# EAGLE design ME433_sunyue (EAGLE 7.2.0)
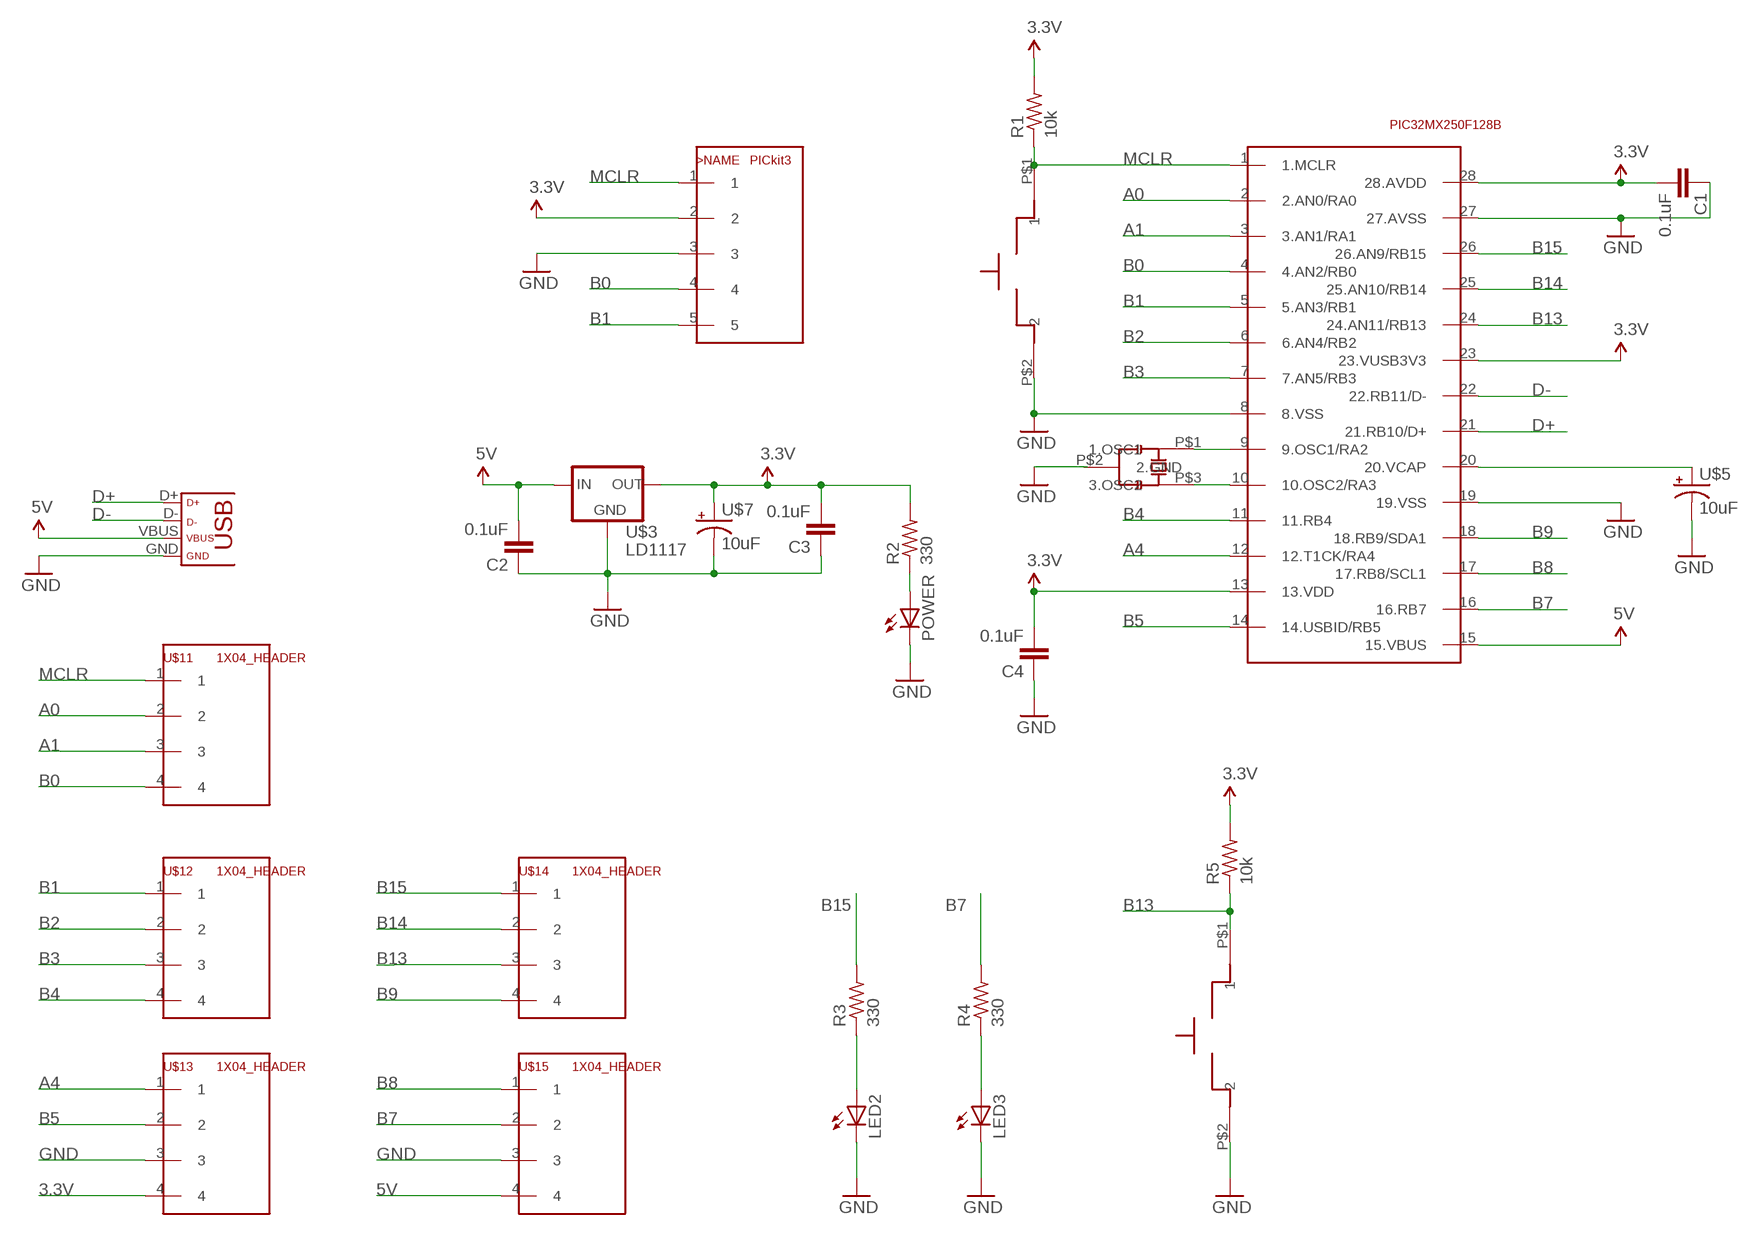
[diagram p0: schematic, sheet 1]

## Parts
>NAME  PICkit3  1X05_HEADER  [1X05]
C1  0.1uF  C-EU025-025X050  [C025-025X050]
C2  0.1uF  C-EU025-025X050  [C025-025X050]
C3  0.1uF  C-EU025-025X050  [C025-025X050]
C4  0.1uF  C-EU025-025X050  [C025-025X050]
LED2  LED3MM  [LED3MM]
LED3  LED3MM  [LED3MM]
POWER  LED3MM  [LED3MM]
R1  10k  R-US_0207/10  [0207/10]
R2  330  R-US_0207/10  [0207/10]
R3  330  R-US_0207/10  [0207/10]
R4  330  R-US_0207/10  [0207/10]
R5  10k  R-US_0207/10  [0207/10]
RESET  RESET  BUTTON  [BUTTON]
U$1  PIC32MX250F128B  [DIL28-3]
U$2  CRYSTAL  [CRYSTAL]
U$3  LD1117  [TO220]
U$5  10uF  CAP_POL  [CAP_POL_D]
U$7  10uF  CAP_POL  [CAP_POL_D]
U$9  USB  [USB-MINIB]
U$11  1X04_HEADER  [1X04]
U$12  1X04_HEADER  [1X04]
U$13  1X04_HEADER  [1X04]
U$14  1X04_HEADER  [1X04]
U$15  1X04_HEADER  [1X04]
USER  BUTTON  [BUTTON]

## Nets
3.3V: >NAME.2 C1.2 C3.2 C4.2 R1.2 R2.2 R5.2 U$1.13(13.VDD) U$1.23(23.VUSB3V3) U$1.28(28.AVDD) U$3.2(OUT) U$7.1(+) U$13.4
5V: C2.2 U$1.15(15.VBUS) U$3.3(IN) U$9.VBUS U$15.4
A0: U$1.2(2.AN0/RA0) U$11.2
A1: U$1.3(3.AN1/RA1) U$11.3
A4: U$1.12(12.T1CK/RA4) U$13.1
B0: >NAME.4 U$1.4(4.AN2/RB0) U$11.4
B1: >NAME.5 U$1.5(5.AN3/RB1) U$12.1
B2: U$1.6(6.AN4/RB2) U$12.2
B3: U$1.7(7.AN5/RB3) U$12.3
B4: U$1.11(11.RB4) U$12.4
B5: U$1.14(14.USBID/RB5) U$13.2
B7: R4.2 U$1.16(16.RB7) U$15.2
B8: U$1.17(17.RB8/SCL1) U$15.1
B9: U$1.18(18.RB9/SDA1) U$14.4
B13: R5.1 U$1.24(24.AN11/RB13) U$14.3 USER.P$1
B14: U$1.25(25.AN10/RB14) U$14.2
B15: R3.2 U$1.26(26.AN9/RB15) U$14.1
D+: U$1.21(21.RB10/D+) U$9.D+
D-: U$1.22(22.RB11/D-) U$9.D-
GND: >NAME.3 C1.1 C2.1 C3.1 C4.1 LED2.K(C) LED3.K(C) POWER.K(C) RESET.P$2 U$1.8(8.VSS) U$1.19(19.VSS) U$1.27(27.AVSS) U$3.1(GND) U$5.2(-) U$7.2(-) U$9.GND U$13.3 U$15.3 USER.P$2
MCLR: >NAME.1 R1.1 RESET.P$1 U$1.1(1.MCLR) U$11.1
N$1: U$1.9(9.OSC1/RA2) U$2.P$1(1.OSC1)
N$2: U$1.10(10.OSC2/RA3) U$2.P$3(3.OSC2)
N$3: U$1.20(20.VCAP) U$5.1(+)
N$4: POWER.A R2.1
N$5: LED2.A R3.1
N$6: LED3.A R4.1
Unconnected: U$2.P$2(2.GND)

## Library data of the parts
>NAME = ME433:1X05_HEADER
C1-C4 = ME433:C-EU: CAPACITOR, European symbol
LED2 LED3 POWER = ME433:LED: LED OSRAM: - CHIPLED LG R971, LG N971, LY N971, LG Q971, LY Q971, LO R971, LY R971 LH N974, LH R974 LS Q976, LO Q976, LY Q976 LO Q996 - Hyper CHIPLED LW Q18S LB Q993, LB Q99A, LB R99A - SideLED LS A670, LO A670, LY A670, LG A670, LP A670 LB A673, LV A673, LT A673, LW A673 LH A674 LY A675 LS A676, LA A676, LO A676, LY A676, LW A676 LS A679, LY A679, LG A679 - Hyper Micro SIDELED® LS Y876, LA Y876, LO Y876, LY Y876 LT Y87S - SmartLED LW L88C, LW L88S LB L89C, LB L89S, LG L890 LS L89K, LO L89K, LY L89K LS L896, LA L896, LO L896, LY L896 - TOPLED LS T670, LO T670, LY T670, LG T670, LP T670 LSG T670, LSP T670, LSY T670, LOP T670, LYG T670 LG T671, LOG T671, LSG T671 LB T673, LV T673, LT T673, LW T673 LH T674 LS T676, LA T676, LO T676, LY T676, LB T676, LH T676, LSB T676, LW T676 LB T67C, LV T67C, LT T67C, LS T67K, LO T67K, LY T67K, LW E67C LS E67B, LA E67B, LO E67B, LY E67B, LB E67C, LV E67C, LT E67C LW T67C LS T679, LY T679, LG T679 LS T770, LO T770, LY T770, LG T770, LP T770 LB T773, LV T773, LT T773, LW T773 LH T774 LS E675, LA E675, LY E675, LS T675 LS T776, LA T776, LO T776, LY T776, LB T776 LHGB T686 LT T68C, LB T68C - Hyper Mini TOPLED® LB M676 - Mini TOPLED Santana® LG M470 LS M47K, LO M47K, LY M47K Source: http://www.osram.convergy.de LUXEON: - LUMILED® LXK2-PW12-R00, LXK2-PW12-S00, LXK2-PW14-U00, LXK2-PW14-V00 LXK2-PM12-R00, LXK2-PM12-S00, LXK2-PM14-U00 LXK2-PE12-Q00, LXK2-PE12-R00, LXK2-PE12-S00, LXK2-PE14-T00, LXK2-PE14-U00 LXK2-PB12-K00, LXK2-PB12-L00, LXK2-PB12-M00, LXK2-PB14-N00, LXK2-PB14-P00, LXK2-PB14-Q00 LXK2-PR12-L00, LXK2-PR12-M00, LXK2-PR14-Q00, LXK2-PR14-R00 LXK2-PD12-Q00, LXK2-PD12-R00, LXK2-PD12-S00 LXK2-PH12-R00, LXK2-PH12-S00 LXK2-PL12-P00, LXK2-PL12-Q00, LXK2-PL12-R00 Source: www.luxeon.com KINGBRIGHT: KA-3528ASYC Source: www.kingbright.com
R1-R5 = ME433:R-US_: RESISTOR, American symbol
RESET USER = ME433:BUTTON
U$1 = ME433:PIC32MX250F128B
U$2 = ME433:CRYSTAL
U$3 = ME433:LD1117
U$5 U$7 = ME433:CAP_POL
U$9 = ME433:USB
U$11-U$15 = ME433:1X04_HEADER

## Board
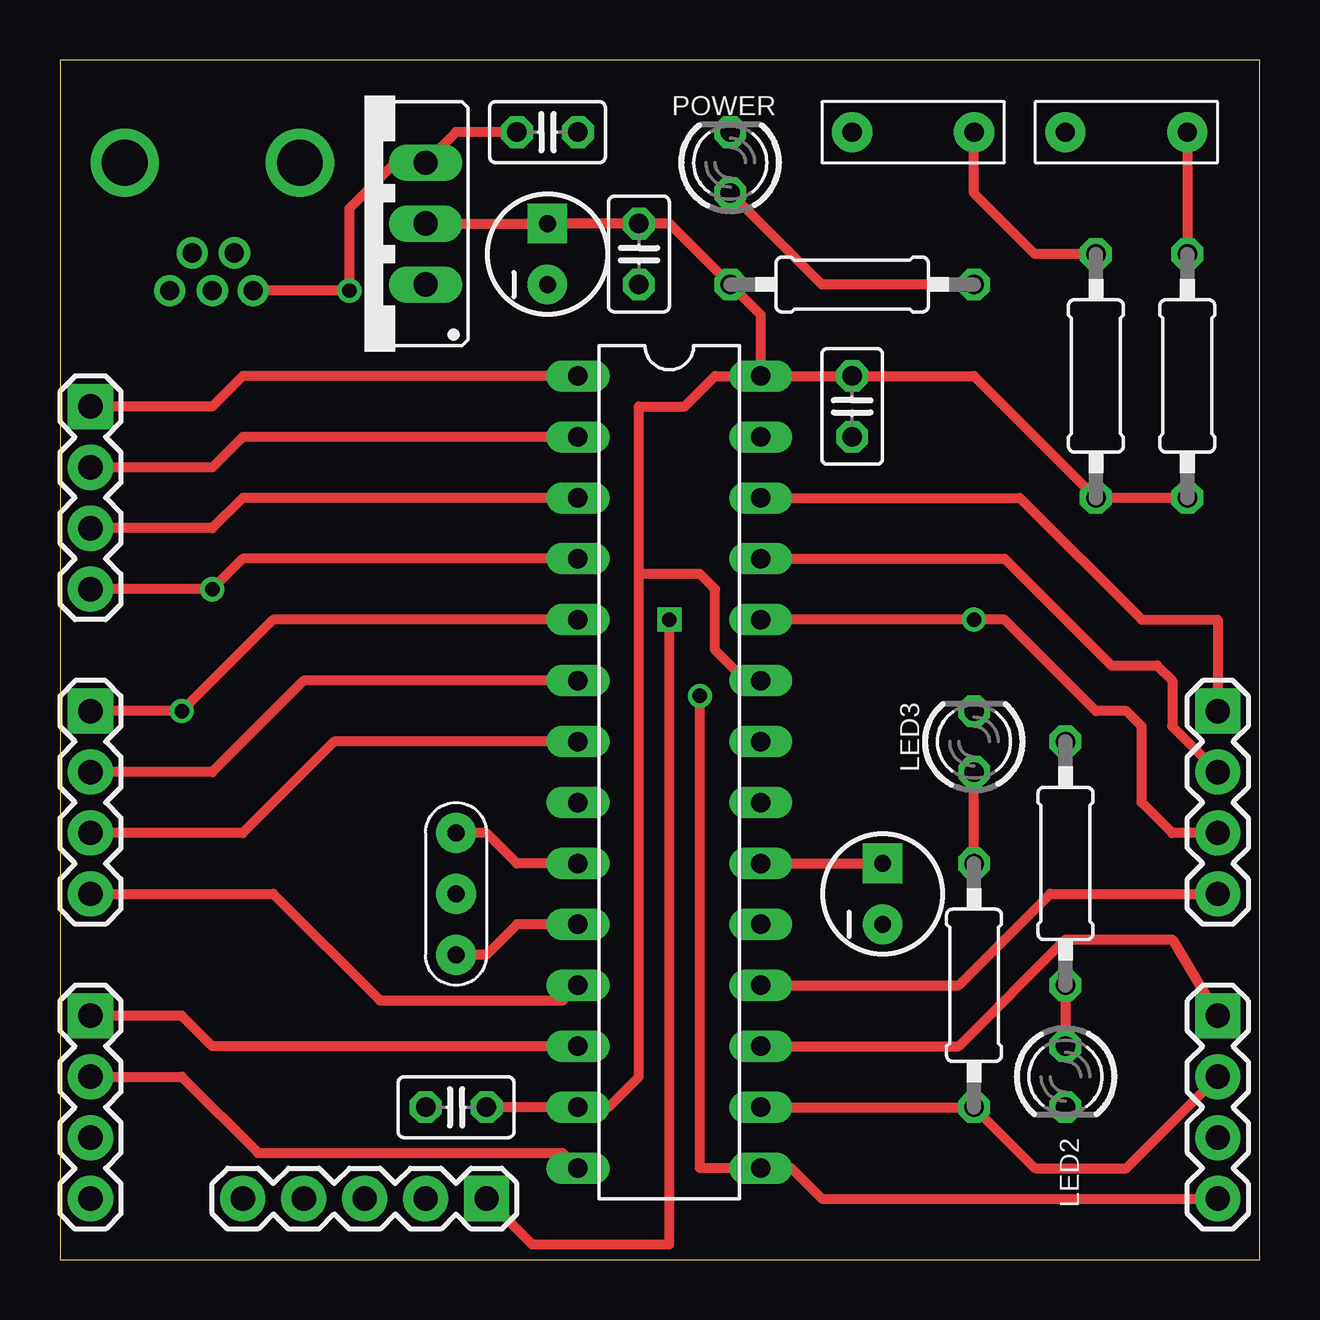
[diagram p1: board, top side]
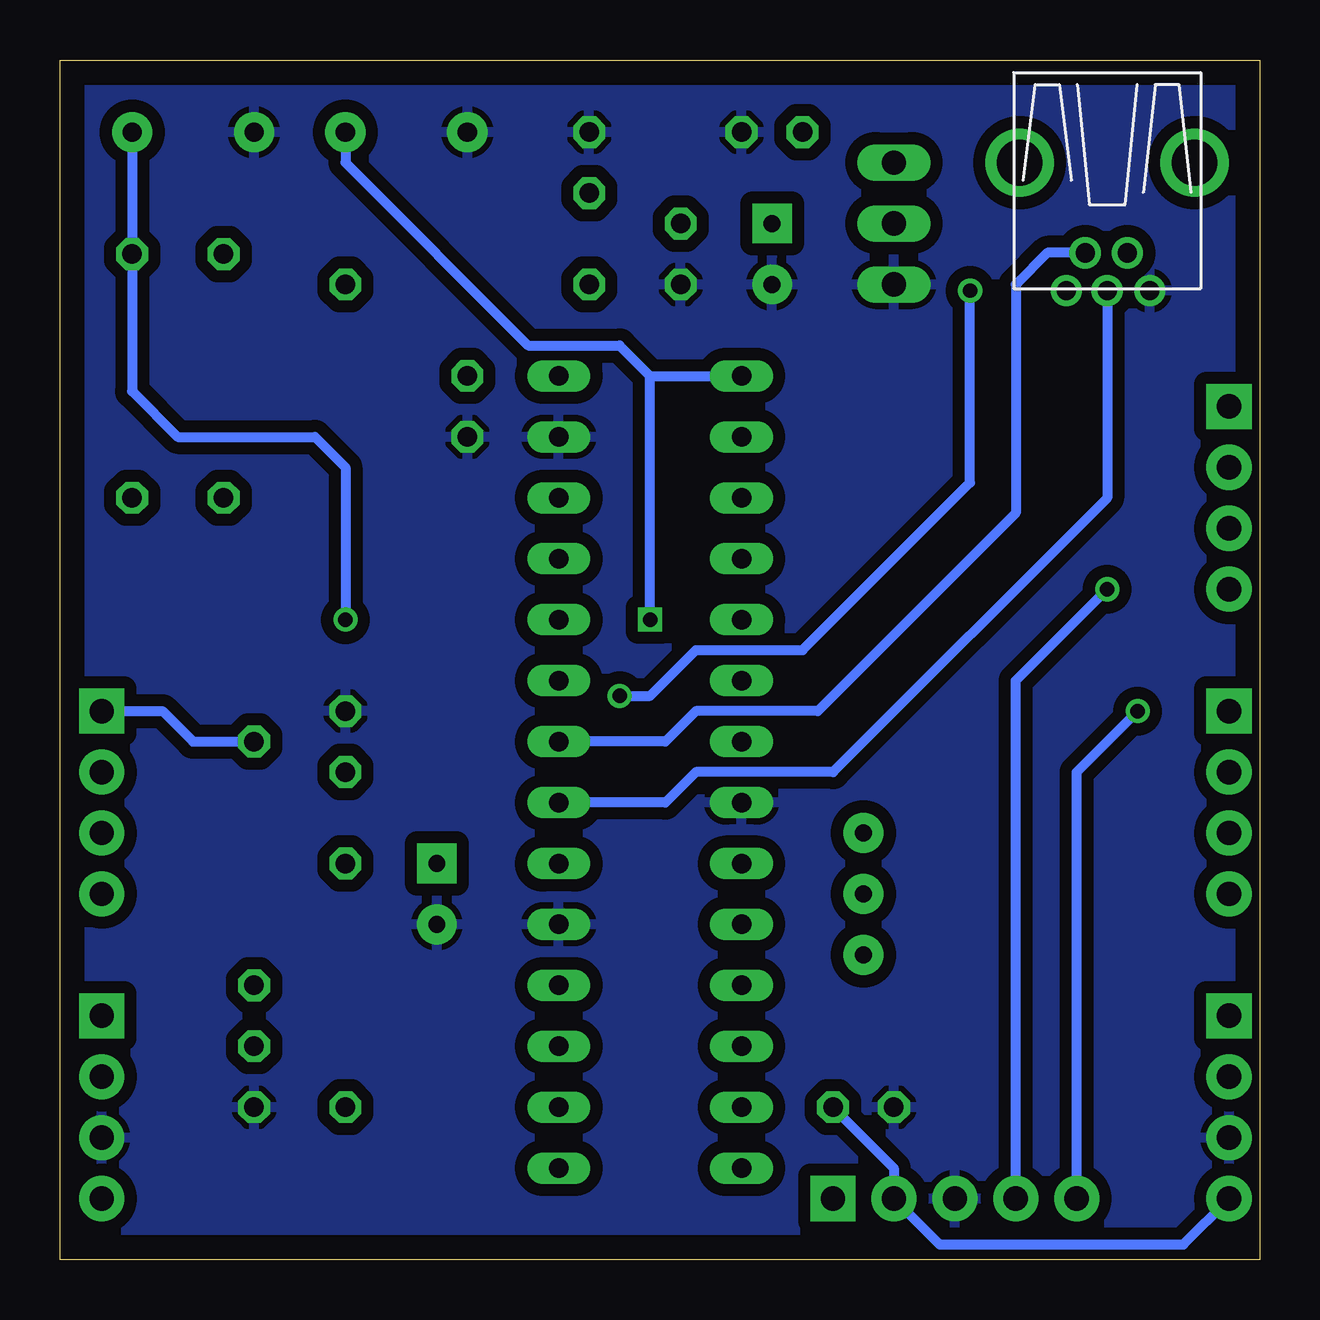
[diagram p2: board, bottom side, seen from below]

Size 50 x 50 mm. Coordinates in mm from the lower left corner, seen from the top.
Outline: 0,0 50,0 50,50 0,50 0,0
Copper layers (1*16): Top 0.035mm / dielectric 1.5mm / Bottom 0.035mm
Design rules "default": minimum track width 10mil, minimum drill 24mil, track to track 8mil, track to pad 8mil, pad to pad 8mil, via to via 8mil, smd to smd 8mil, copper to edge 40mil, drill to drill 8mil, minimum pad ring 10mil, minimum via ring 8mil, stop-mask expansion 4mil, vias tented up to drill 0mil, thermal gap 10mil

### Footprints (pad centres in the part's own frame; a part is rotated, then mirrored left to right if it is on the bottom)
1X05 = drill 1.016 pad 1.88 square: 1 0,0 | drill 1.016 pad 1.88: 2 2.54,0; 3 5.08,0; 4 7.62,0; 5 10.16,0
C025-025X050 = drill 0.813 octagon: 1 -1.27,0; 2 1.27,0
LED3MM = drill 0.813 octagon: A -1.27,0; K 1.27,0
0207/10 = drill 0.813 octagon: 1 -5.08,0; 2 5.08,0
BUTTON = drill 0.8 pad 1.676: P$1 -2.54,0; P$2 2.54,0
DIL28-3 = drill 0.813 long: 1 -16.51,-3.81; 2 -13.97,-3.81; 3 -11.43,-3.81; 4 -8.89,-3.81; 5 -6.35,-3.81; 6 -3.81,-3.81; 7 -1.27,-3.81; 8 1.27,-3.81; 9 3.81,-3.81; 10 6.35,-3.81; 11 8.89,-3.81; 12 11.43,-3.81; 13 13.97,-3.81; 14 16.51,-3.81; 15 16.51,3.81; 16 13.97,3.81; 17 11.43,3.81; 18 8.89,3.81; 19 6.35,3.81; 20 3.81,3.81; 21 1.27,3.81; 22 -1.27,3.81; 23 -3.81,3.81; 24 -6.35,3.81; 25 -8.89,3.81; 26 -11.43,3.81; 27 -13.97,3.81; 28 -16.51,3.81
CRYSTAL = drill 0.7 pad 1.676: P$1 -2.54,0; P$2 0,0; P$3 2.54,0
TO220 = drill 1.016 long: 1 -2.54,0; 2 0,0; 3 2.54,0
CAP_POL_D = drill 0.7 pad 1.651 square: 1 1.27,0 | drill 0.7 pad 1.651: 2 -1.27,0
USB-MINIB = drill 0.8: D+ 4.064,0; D- 2.489,0.914; GND 4.064,-1.778; ID 2.489,-0.838; VBUS 4.064,1.702 | drill 1.9: P$6 -1.27,-3.65; P$7 -1.27,3.65
1X04 = drill 1.016 pad 1.88 square: 1 0,0 | drill 1.016 pad 1.88: 2 2.54,0; 3 5.08,0; 4 7.62,0

### Placement (x,y rotation side)
>NAME  17.78,2.54 180 top
C1  24.13,41.91 90 top
C2  20.32,46.99 180 top
C3  33.02,35.56 90 top
C4  16.51,6.35 0 top
LED2  41.91,7.62 270 top
LED3  38.1,21.59 90 top
POWER  27.94,45.72 90 top
R1  43.18,36.83 270 top
R2  33.02,40.64 180 top
R3  41.91,16.51 90 top
R4  38.1,11.43 270 top
R5  46.99,36.83 270 top
RESET  35.56,46.99 180 top
U$1  25.4,20.32 270 top
U$2  16.51,15.24 270 top
U$3  15.24,43.18 90 top
U$5  34.29,15.24 90 top
U$7  20.32,41.91 90 top
U$9  6.35,44.45 270 top
U$11  1.27,35.56 270 top
U$12  1.27,22.86 270 top
U$13  1.27,10.16 270 top
U$14  48.26,22.86 270 top
U$15  48.26,10.16 270 top
USER  44.45,46.99 180 top

### Tracks (layer width: path | path; a pad name or v marks a point on that pad's centre or on a via)
3.3V
  Top 0.406: R5.2 R1.2 38.1,36.83 C3.2 U$1.28 | U$1.28 29.21,39.37 R2.2 25.4,43.18 C1.2 U$7.1 U$3.2 | C4.2 U$1.13 22.86,6.35 24.13,7.62 24.13,28.57 | 24.13,28.57 24.13,35.56 26.04,35.56 27.3,36.83 U$1.28 | U$1.23 28.57,24.13 27.3,25.4 27.3,27.94 26.67,28.57 24.13,28.57
  Bottom 0.406: C4.2 15.24,3.81 >NAME.2 13.34,0.64 3.17,0.64 U$13.4
5V  (via drill 0.6)
  Top 0.406: C2.2 16.51,46.99 U$3.3 13.97,45.72 12.06,43.81 12.06,40.64 11.81,40.39 v12.06,40.39 U$9.VBUS | U$15.4 31.75,2.54 30.48,3.81 U$1.15 26.67,3.81 v26.67,23.5
  Bottom 0.406: v26.67,23.5 25.4,23.5 23.5,25.4 19.05,25.4 12.06,32.38 v12.06,40.39
A0
  Top 0.406: U$1.2 7.62,34.29 6.35,33.02 U$11.2
A1
  Top 0.406: U$1.3 7.62,31.75 6.35,30.48 U$11.3
A4
  Top 0.406: U$1.12 6.35,8.89 5.08,10.16 U$13.1
B0  (via drill 0.6)
  Top 0.406: U$1.4 7.62,29.21 v6.35,27.94 U$11.4
  Bottom 0.406: >NAME.4 10.16,24.13 v6.35,27.94
B1  (via drill 0.6)
  Top 0.406: U$1.5 8.89,26.67 v5.08,22.86 U$12.1
  Bottom 0.406: >NAME.5 7.62,20.32 v5.08,22.86
B2
  Top 0.406: U$1.6 10.16,24.13 6.35,20.32 U$12.2
B3
  Top 0.406: U$1.7 11.43,21.59 7.62,17.78 U$12.3
B4
  Top 0.406: U$12.4 8.89,15.24 13.34,10.79 20.95,10.79 U$1.11
B5
  Top 0.406: U$13.2 5.08,7.62 8.26,4.45 20.95,4.45 U$1.14
B7
  Top 0.406: U$1.16 R4.2 40.64,3.81 44.45,3.81 U$15.2
B8
  Top 0.406: U$1.17 37.47,8.89 41.91,13.34 46.35,13.34 U$15.1
B9
  Top 0.406: U$1.18 37.47,11.43 41.27,15.24 U$14.4
B13  (via drill 0.6)
  Top 0.406: USER.P$1 R5.1 | U$1.24 v38.1,26.67 39.37,26.67 43.18,22.86 44.45,22.86 45.09,22.23 45.09,19.05 46.35,17.78 U$14.3
  Bottom 0.406: USER.P$1 46.99,36.2 45.09,34.29 39.37,34.29 38.1,33.02 v38.1,26.67
B14
  Top 0.406: U$1.25 39.37,29.21 43.81,24.77 45.72,24.77 46.35,24.13 46.35,22.23 U$14.2
B15
  Top 0.406: U$1.26 40.01,31.75 45.09,26.67 48.26,26.67 U$14.1
  Bottom 0.406: U$14.1 45.72,22.86 44.45,21.59 R3.2
D+
  Bottom 0.406: U$9.D+ 6.35,31.75 17.78,20.32 23.5,20.32 24.77,19.05 U$1.21
D-
  Bottom 0.406: U$9.D- 8.84,41.96 10.16,40.64 10.16,31.11 18.41,22.86 23.5,22.86 24.77,21.59 U$1.22
GND
  pour Bottom (isolate 0.508): 0,50.16 0,0 50.16,0 50.16,50.16
MCLR  (via drill 0.6)
  Top 0.406: R1.1 40.64,41.91 38.1,44.45 RESET.P$1 | U$1.1 7.62,36.83 6.35,35.56 U$11.1 | >NAME.1 19.68,0.64 25.4,0.64 v25.4,26.67
  Bottom 0.406: RESET.P$1 38.1,45.72 30.48,38.1 26.67,38.1 25.4,36.83 | 25.4,36.83 U$1.1 | v25.4,26.67 25.4,36.83
N$1
  Top 0.406: U$1.9 19.05,16.51 17.78,17.78 U$2.P$1
N$2
  Top 0.406: U$1.10 19.05,13.97 17.78,12.7 U$2.P$3
N$3
  Top 0.406: U$1.20 U$5.1
N$4
  Top 0.406: R2.1 31.75,40.64 POWER.A
N$5
  Top 0.406: R3.1 LED2.A
N$6
  Top 0.406: R4.1 LED3.A

### Text on the board
tValues: RESET | USER | MCLR | A0 | A1 | B0 | B1 | B15 | B2 | B14 | NU Yue Sun | B3 | B13 | B4 | B9 | 8MHz | PIC32MX250F128B | A4 | B8 | B5 | B7 | GND | GND | 3.3V | 5V